# EAGLE design speech2 (EAGLE 7.6.0)
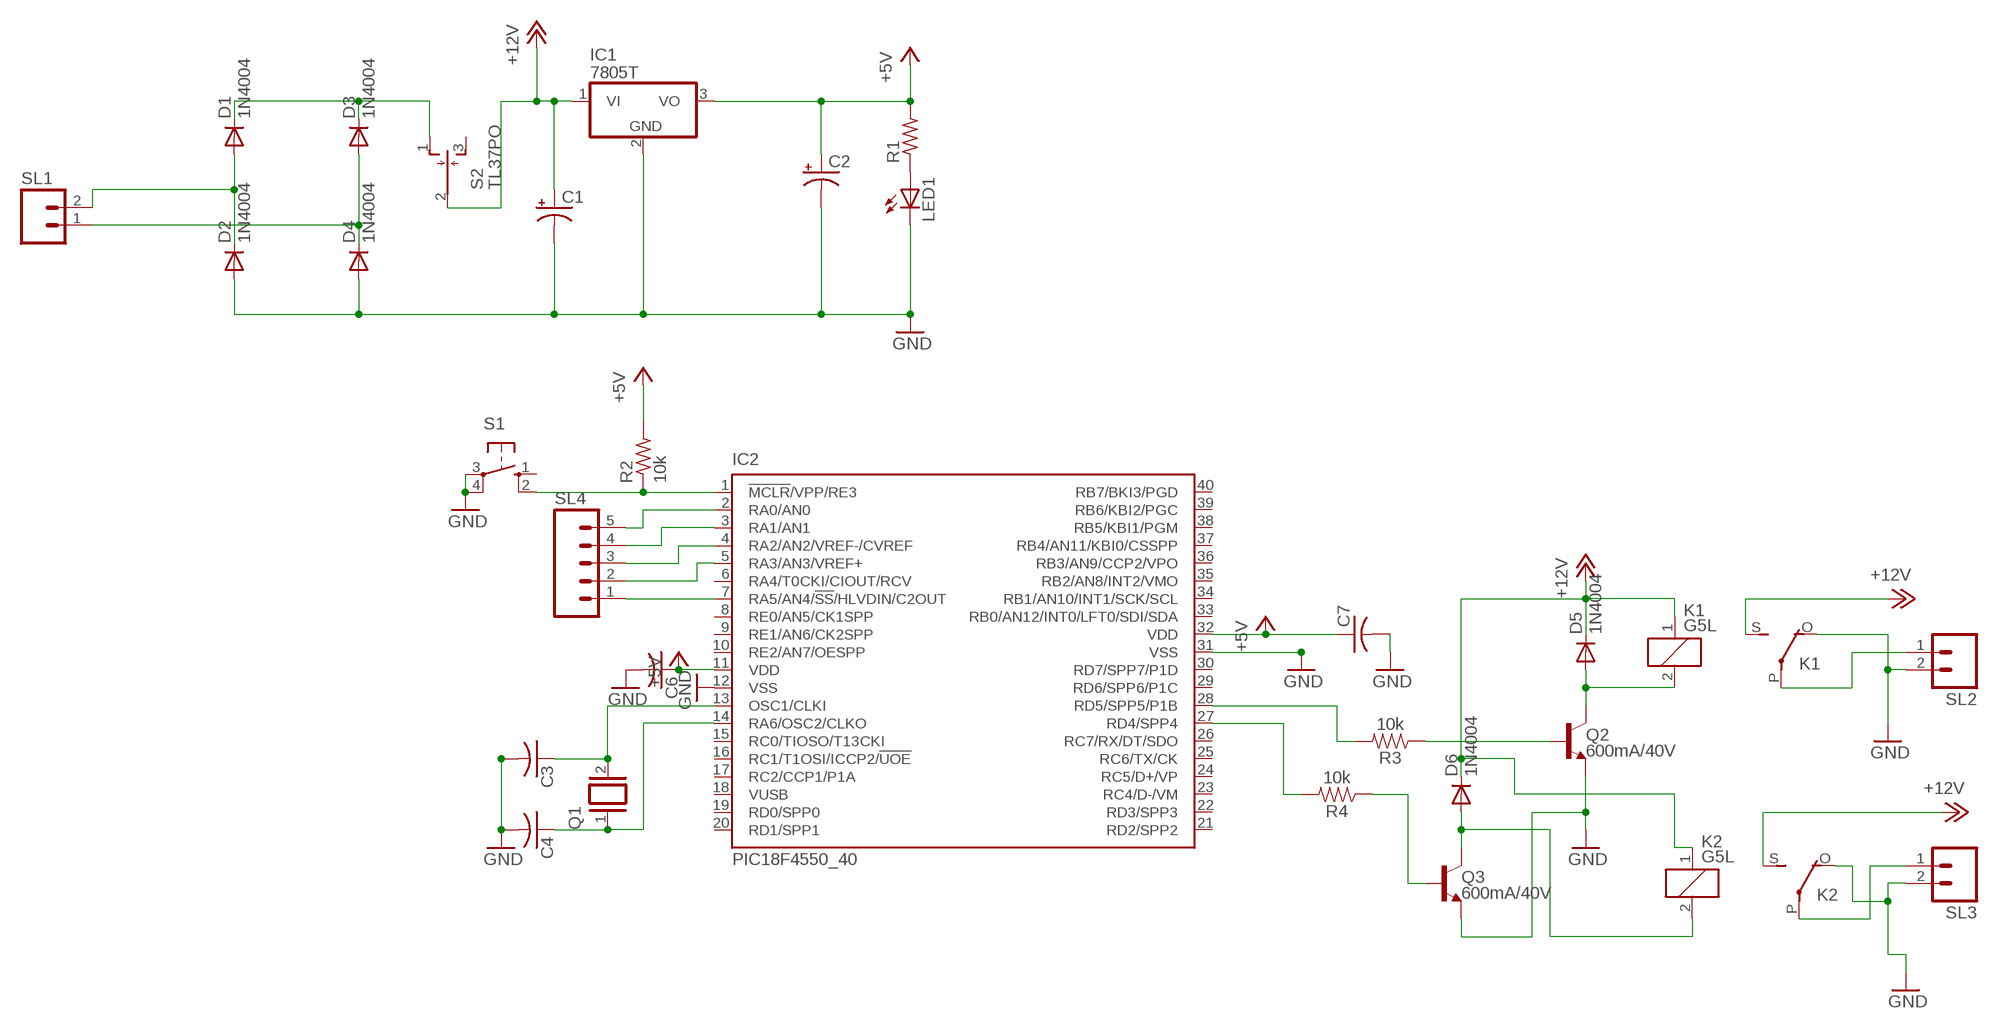
[diagram p0: schematic, sheet 1]

## Parts
C1  CPOL-USE3.5-8  [E3,5-8]
C2  CPOL-USE3.5-8  [E3,5-8]
C3  C-US025-024X044  [C025-024X044]
C4  C-US025-024X044  [C025-024X044]
C6  C-US025-024X044  [C025-024X044]
C7  C-US025-024X044  [C025-024X044]
D1  1N4004  [DO41-10]
D2  1N4004  [DO41-10]
D3  1N4004  [DO41-10]
D4  1N4004  [DO41-10]
D5  1N4004  [DO41-10]
D6  1N4004  [DO41-10]
IC1  7805T  [TO220H]
IC2  PIC18F4550_40  [DIL40]
K1  G5L  [G5LE]
K2  G5L  [G5LE]
LED1  LED5MM  [LED5MM]
Q1  XTAL/S  [QS]
Q2  600mA/40V  TRANS_NPN-P2N2222A  [TO-92]
Q3  600mA/40V  TRANS_NPN-P2N2222A  [TO-92]
R1  R-US_0207/10  [0207/10]
R2  10k  R-US_0207/10  [0207/10]
R3  10k  10KOHM-HORIZ-1/4W-1%  [AXIAL-0.3]
R4  10k  10KOHM-HORIZ-1/4W-1%  [AXIAL-0.3]
S1  10-XX  [B3F-10XX]
S2  TL37PO  [TL3XPO]
SL1  MA02  [02PA]
SL2  MA02  [02PA]
SL3  MA02  [02PA]
SL4  MA05  [05PA]

## Nets
+5V: C2.+ C6.1 C7.1 IC1.3(VO) IC2.11(VDD) IC2.32(VDD) R1.2 R2.2
+12V: C1.+ D5.C D6.C IC1.1(VI) K1.1 K1.S(2:S) K2.1 K2.S(2:S) S2.2(P)
GND: C1.- C2.- C3.2 C4.2 C6.2 C7.2 D2.A D4.A IC1.2(GND) IC2.12(VSS) IC2.31(VSS) K1.O(2:O) K2.O(2:O) LED1.K(C) Q2.3(E) Q3.3(E) S1.3(P) S1.4(P1) SL2.2 SL3.2
N$2: D1.A D2.C SL1.2
N$3: D3.A D4.C SL1.1
N$4: IC2.27(RD4/SPP4) R4.P$2
N$5: Q3.2(B) R4.P$1
N$6: LED1.A R1.1
N$8: D5.A K1.2 Q2.1(C)
N$9: IC2.2(RA0/AN0) SL4.5
N$10: IC2.28(RD5/SPP5/P1B) R3.P$2
N$11: IC2.1(!MCLR!/VPP/RE3) R2.1 S1.2(S1)
N$12: Q2.2(B) R3.P$1
N$13: IC2.3(RA1/AN1) SL4.4
N$14: IC2.4(RA2/AN2/VREF-/CVREF) SL4.3
N$15: IC2.5(RA3/AN3/VREF+) SL4.2
N$16: D6.A K2.2 Q3.1(C)
N$17: K2.P(2:P) SL3.1
N$18: IC2.7(RA5/AN4/!SS!/HLVDIN/C2OUT) SL4.1
N$22: K1.P(2:P) SL2.1
N$24: C4.1 IC2.14(RA6/OSC2/CLKO) Q1.1
N$25: C3.1 IC2.13(OSC1/CLKI) Q1.2
N$114: D1.C D3.C S2.1(O)
Unconnected: IC2.6(RA4/T0CKI/CIOUT/RCV) IC2.8(RE0/AN5/CK1SPP) IC2.9(RE1/AN6/CK2SPP) IC2.10(RE2/AN7/OESPP) IC2.15(RC0/TIOSO/T13CKI) IC2.16(RC1/T1OSI/ICCP2/!UOE) IC2.17(RC2/CCP1/P1A) IC2.18(VUSB) IC2.19(RD0/SPP0) IC2.20(RD1/SPP1) IC2.21(RD2/SPP2) IC2.22(RD3/SPP3) IC2.23(RC4/D-/VM) IC2.24(RC5/D+/VP) IC2.25(RC6/TX/CK) IC2.26(RC7/RX/DT/SDO) IC2.29(RD6/SPP6/P1C) IC2.30(RD7/SPP7/P1D) IC2.33(RB0/AN12/INT0/LFT0/SDI/SDA) IC2.34(RB1/AN10/INT1/SCK/SCL) IC2.35(RB2/AN8/INT2/VMO) IC2.36(RB3/AN9/CCP2/VPO) IC2.37(RB4/AN11/KBI0/CSSPP) IC2.38(RB5/KBI1/PGM) IC2.39(RB6/KBI2/PGC) IC2.40(RB7/BKI3/PGD) S1.1(S) S2.3(S)

## Library data of the parts
C1 C2 = adafruit:CPOL-US: POLARIZED CAPACITOR, American symbol
C3 C4 C6 C7 = adafruit:C-US: CAPACITOR, American symbol
D1-D6 = diode:1N4004: DIODE general purpose rectifier, 1 A
IC1 = adafruit:78*: Positive VOLTAGE REGULATOR Added bigger pads to the TO-92 package
IC2 = microchip:PIC18F4*_40: USB Microcontrollers with nanoWatt Technology High-Performance, Enhanced Flash, 28/40/44-Pin, Source: http://ww1.microchip.com/downloads/en/devicedoc/39632c.pdf; MF: MICROCHIP; MPN: PIC18F4550-I/P; OC_FARNELL: 9321357; OC_NEWARK: 74K8623
K1 K2 = relay:G5L: RELAY 1 x switch, 10 A/120 V AC, 8 A/30 V ADC, Omron; OC_FARNELL: unknown; OC_NEWARK: unknown
LED1 = adafruit:LED: LED OSRAM: - CHIPLED LG R971, LG N971, LY N971, LG Q971, LY Q971, LO R971, LY R971 LH N974, LH R974 LS Q976, LO Q976, LY Q976 LO Q996 - Hyper CHIPLED LW Q18S LB Q993, LB Q99A, LB R99A - SideLED LS A670, LO A670, LY A670, LG A670, LP A670 LB A673, LV A673, LT A673, LW A673 LH A674 LY A675 LS A676, LA A676, LO A676, LY A676, LW A676 LS A679, LY A679, LG A679 - Hyper Micro SIDELED® LS Y876, LA Y876, LO Y876, LY Y876 LT Y87S - SmartLED LW L88C, LW L88S LB L89C, LB L89S, LG L890 LS L89K, LO L89K, LY L89K LS L896, LA L896, LO L896, LY L896 - TOPLED LS T670, LO T670, LY T670, LG T670, LP T670 LSG T670, LSP T670, LSY T670, LOP T670, LYG T670 LG T671, LOG T671, LSG T671 LB T673, LV T673, LT T673, LW T673 LH T674 LS T676, LA T676, LO T676, LY T676, LB T676, LH T676, LSB T676, LW T676 LB T67C, LV T67C, LT T67C, LS T67K, LO T67K, LY T67K, LW E67C LS E67B, LA E67B, LO E67B, LY E67B, LB E67C, LV E67C, LT E67C LW T67C LS T679, LY T679, LG T679 LS T770, LO T770, LY T770, LG T770, LP T770 LB T773, LV T773, LT T773, LW T773 LH T774 LS E675, LA E675, LY E675, LS T675 LS T776, LA T776, LO T776, LY T776, LB T776 LHGB T686 LT T68C, LB T68C - Hyper Mini TOPLED® LB M676 - Mini TOPLED Santana® LG M470 LS M47K, LO M47K, LY M47K Source: http://www.osram.convergy.de/
Q1 = special:XTAL/S: CRYSTAL
Q2 Q3 = SparkFun-DiscreteSemi:TRANS_NPN: NPN transistor Current controlled devices typically used to amplify current or used as a switch. BC547 - COM-08928 <http://www.sparkfun.com/products/8928> (TO-92 45V 100mA) (1.Collector 2.Base 3.Emitter) 2N3904 - COM-00521 <http://www.sparkfun.com/products/521> (TO-92 40V 200mA) (1.Emitter 2.Base 3.Collector) P2N2222A - COM-12852 <http://www.sparkfun.com/products/12852> (TO-92 40V 600mA) (1.Collector 2.Base 3.Emitter); PROD_ID: TRANS-09536
R1 R2 = adafruit:R-US_: RESISTOR, American symbol
R3 R4 = SparkFun-Resistors:10KOHM: 10kΩ resistor A resistor is a passive two-terminal electrical component that implements electrical resistance as a circuit element. Resistors act to reduce current flow, and, at the same time, act to lower voltage levels within circuits. - Wikipedia; PROD_ID: RES-12183
S1 = switch-omron:10-XX: OMRON SWITCH; MPN: B3F-1000; OC_FARNELL: 176432; OC_NEWARK: 36M3542
S2 = switch:TL37PO: TINY SWITCH MOM OFF MOM Source: http://www2.produktinfo.conrad.com/datenblaetter/700000-724999/705152-da-01-de-Subminiaturschalter_TL_36YO.pdf
SL1-SL3 = con-amp-quick:MA02: AMP QUICK CONNECTOR; OC_FARNELL: unknown; OC_NEWARK: unknown
SL4 = con-amp-quick:MA05: AMP QUICK CONNECTOR; OC_FARNELL: unknown; OC_NEWARK: unknown

## Board
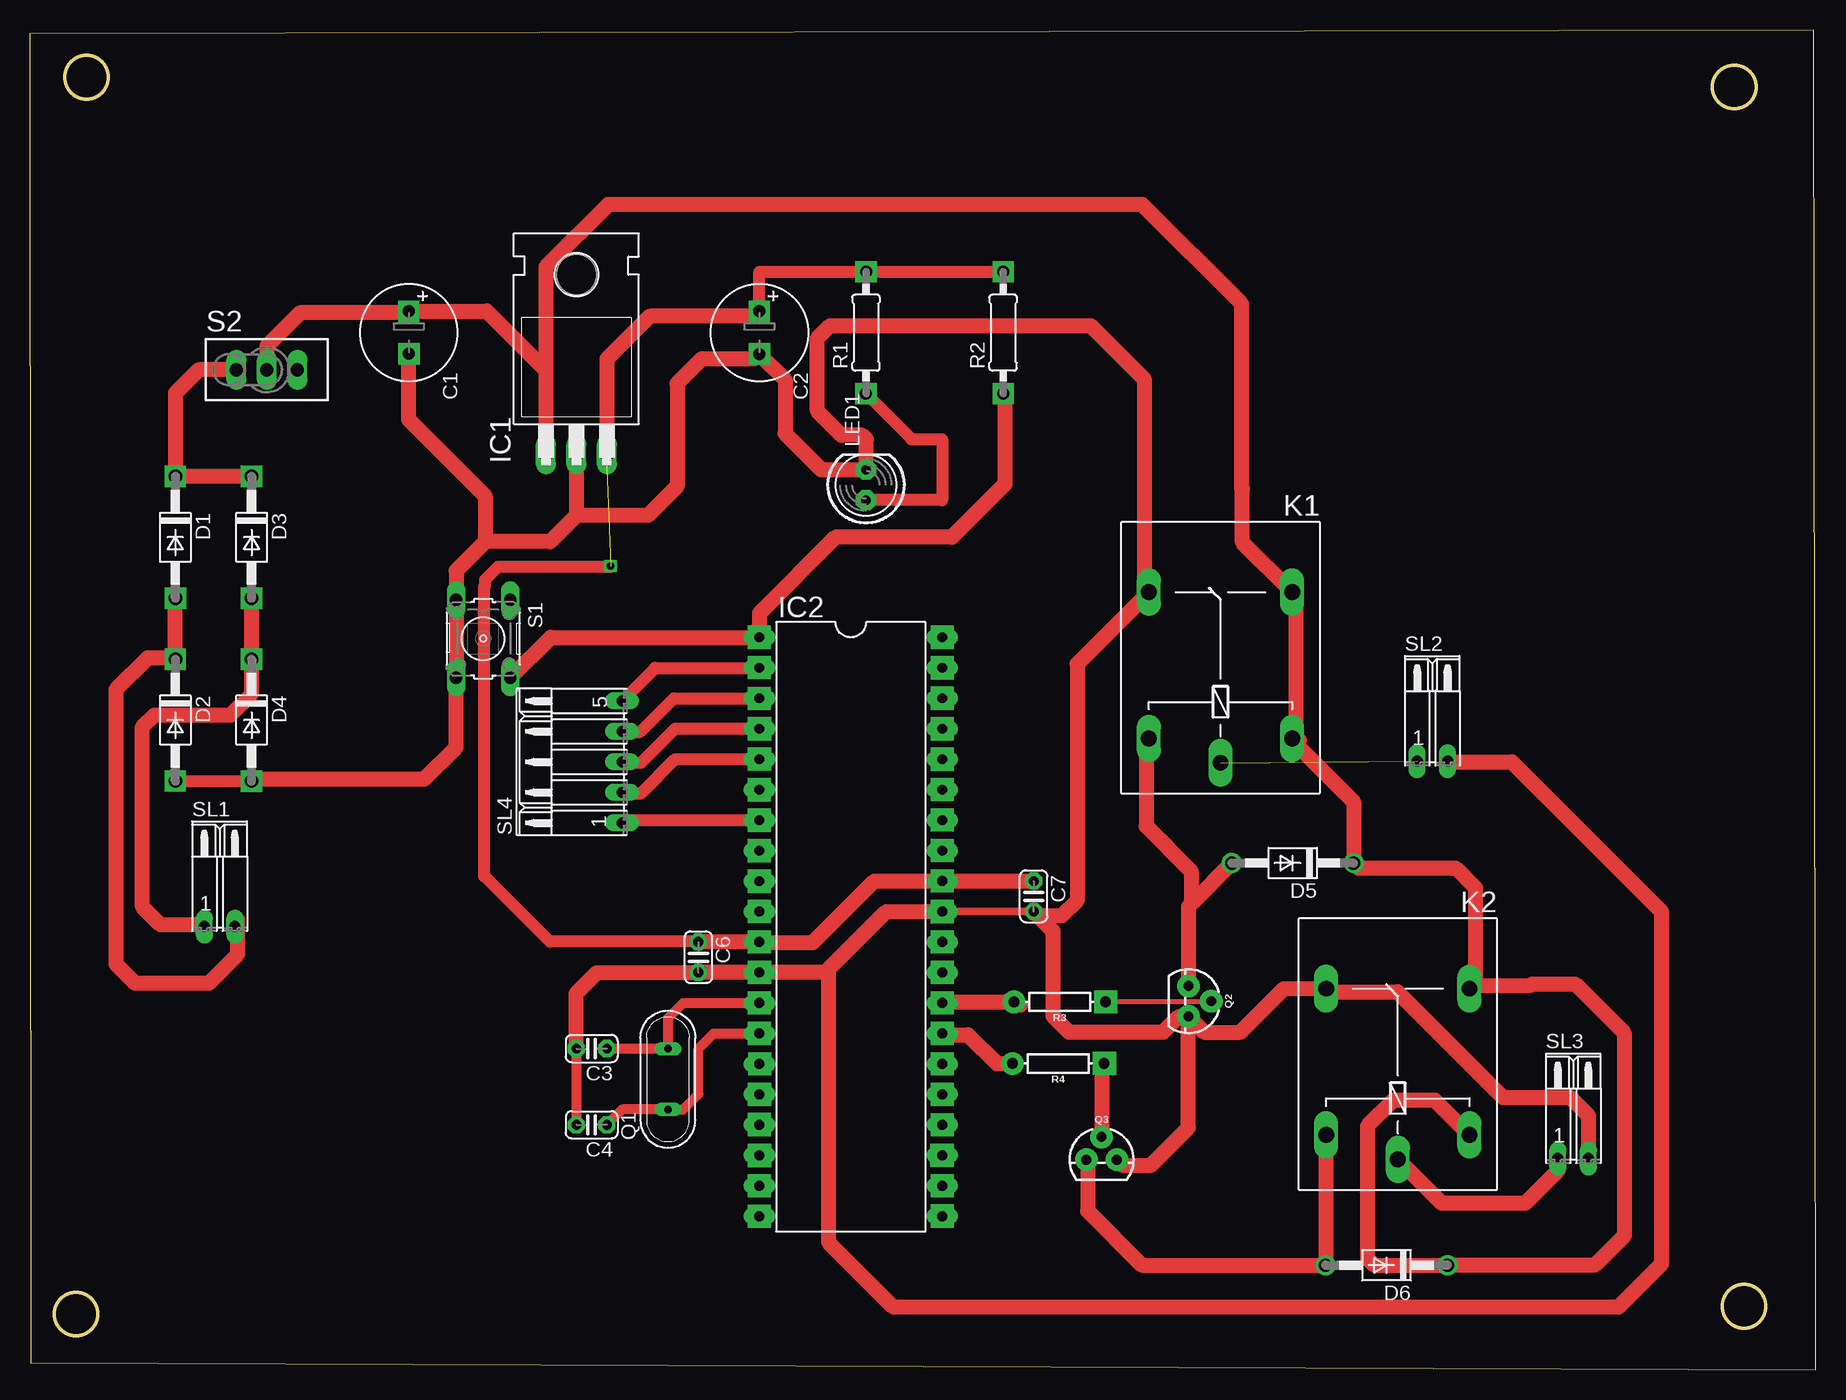
[diagram p1: board, top side]

Size 148.82 x 111.67 mm. Coordinates in mm from the lower left corner, seen from the top.
Outline: 0.08,0.55 148.82,0 148.63,111.67 0,111.36 0.08,0.55
Outline: circle at 4.71,107.74 radius 1.8
Outline: circle at 3.84,4.63 radius 1.8
Outline: circle at 142.84,5.27 radius 1.8
Outline: circle at 142.01,106.91 radius 1.8
Copper layers (1*16): Top 0.035mm / dielectric 1.5mm / Bottom 0.035mm
Design rules "default": minimum track width 10mil, minimum drill 24mil, track to track 8mil, track to pad 8mil, pad to pad 8mil, via to via 8mil, smd to smd 8mil, copper to edge 40mil, drill to drill 8mil, minimum pad ring 10mil, minimum via ring 8mil, stop-mask expansion 4mil, vias tented up to drill 0mil, thermal gap 10mil

### Footprints (pad centres in the part's own frame; a part is rotated, then mirrored left to right if it is on the bottom)
E3,5-8 = drill 0.813 pad 1.6: + -1.778,0 | drill 0.813 pad 1.6 octagon: - 1.778,0
C025-024X044 = drill 0.813 pad 1.422 octagon: 1 -1.27,0; 2 1.27,0
DO41-10 = drill 1.118: A 5.08,0; C -5.08,0
TO220H = drill 1.118 long: 1 -2.54,-10.16; 2 0,-10.16; 3 2.54,-10.16 | hole 3.302: 0,4.826
DIL40 = drill 0.813 long: 1 -24.13,-7.62; 2 -21.59,-7.62; 3 -19.05,-7.62; 4 -16.51,-7.62; 5 -13.97,-7.62; 6 -11.43,-7.62; 7 -8.89,-7.62; 8 -6.35,-7.62; 9 -3.81,-7.62; 10 -1.27,-7.62; 11 1.27,-7.62; 12 3.81,-7.62; 13 6.35,-7.62; 14 8.89,-7.62; 15 11.43,-7.62; 16 13.97,-7.62; 17 16.51,-7.62; 18 19.05,-7.62; 19 21.59,-7.62; 20 24.13,-7.62; 21 24.13,7.62; 22 21.59,7.62; 23 19.05,7.62; 24 16.51,7.62; 25 13.97,7.62; 26 11.43,7.62; 27 8.89,7.62; 28 6.35,7.62; 29 3.81,7.62; 30 1.27,7.62; 31 -1.27,7.62; 32 -3.81,7.62; 33 -6.35,7.62; 34 -8.89,7.62; 35 -11.43,7.62; 36 -13.97,7.62; 37 -16.51,7.62; 38 -19.05,7.62; 39 -21.59,7.62; 40 -24.13,7.62
G5LE = drill 1.321 long: 1 -7.493,-5.969; 2 -7.493,5.969; O 4.699,5.969; P -9.525,0; S 4.699,-5.969
LED5MM = drill 0.813 pad 1.676 octagon: A -1.27,0; K 1.27,0
QS = drill 0.61 long: 1 -2.54,0; 2 2.54,0
TO-92 = drill 0.813 pad 1.88: 1 -1.27,0; 2 0,1.905; 3 1.27,0
0207/10 = drill 0.813 pad 1.676 octagon: 1 -5.08,0; 2 5.08,0
AXIAL-0.3 = drill 0.9 pad 1.88: P$1 -3.81,0; P$2 3.81,0
B3F-10XX = drill 1.016 long: 1 -3.251,2.261; 2 3.251,2.261; 3 -3.251,-2.261; 4 3.251,-2.261
TL3XPO = drill 1.1 pad 1.422 long: 1 -2.54,0; 2 0,0; 3 2.54,0
02PA = drill 0.914 long: 1 -1.27,0; 2 1.27,0
05PA = drill 0.914 long: 1 -5.08,0; 2 -2.54,0; 3 0,0; 4 2.54,0; 5 5.08,0

### Placement (x,y rotation side)
C1  31.57,86.44 270 top
C2  60.78,86.44 270 top
C3  46.81,26.75 180 top
C4  46.81,20.4 180 top
C6  55.7,34.37 270 top
C7  83.64,39.45 270 top
D1  12.11,69.38 270 top
D2  12.11,54.14 270 top
D3  18.46,69.38 270 top
D4  18.46,54.14 270 top
D5  105.23,42.22 180 top
D6  113.05,8.69 180 top
IC1  45.54,86.44 0 top
IC2  68.4,36.91 270 top
K1  99.21,60.11 90 top
K2  113.98,27.05 90 top
LED1  69.67,73.74 90 top
Q1  53.16,24.21 90 top
Q2  96.53,30.71 270 top
Q3  89.3,17.48 0 top
R1  69.67,86.44 90 top
R2  81.1,86.44 90 top
R3  85.81,30.65 180 top
R4  85.68,25.51 180 top
S1  37.77,60.92 270 top
S2  19.73,83.34 0 top
SL1  15.8,36.93 0 top
SL2  116.86,50.73 0 top
SL3  128.6,17.59 0 top
SL4  49.34,50.66 90 top

### Tracks (layer width: path | path; a pad name or v marks a point on that pad's centre or on a via)
+5V  (1 unrouted)
  Top 1.016: C2.+ 60.78,91.52 R1.2 R2.2 | C6.1 55.66,35.67 43.31,35.67 37.85,41.14 37.85,65.27 37.93,65.35 37.93,65.85 39.01,66.92 48.45,66.92
  Top 1.27: C6.1 IC2.11 60.83,35.59 65.24,35.59 70.37,40.72 IC2.32 C7.1 | C2.+ 60.36,87.79 51.63,87.79 48.08,84.25 IC1.3
+12V
  Top 1.27: S2.2 19.73,85.32 22.51,88.1 31.45,88.1 C1.+ 31.6,88.25 38.07,88.25 43,83.32 | 43,83.32 43,81.4 IC1.1 | 105.48,52.14 105.48,64.5 K1.S 101.02,68.96 101.02,73.42 100.97,73.48 100.97,88.84 92.7,97.11 48.17,97.11 43,91.94 43,83.32 | 105.48,52.14 105.78,52.44 | 105.78,52.44 | 105.78,52.44 105.61,52.61 K1.1 | K2.1 117.06,22.45 113.6,22.45 111.46,20.31 111.46,9.26 112.03,8.69 D6.C 130.38,8.69 132.83,11.14 132.83,28.06 128.76,32.14 125.18,32.14 125.08,32.04 120.45,32.04 | K2.S 120.24,32.04 120.45,32.04 | 105.48,52.14 110.31,47.32 D5.C 110.72,41.81 118.79,41.81 120.45,40.15 120.45,32.04
GND
  Top 0.61: IC2.31 C7.2
  Top 0.813: C3.2 C4.2
  Top 1.016: D2.A D4.A
  Top 1.27: 66.56,33.38 66.35,33.16 60.84,33.16 IC2.12 C6.2 47.26,33.1 45.5,31.35 45.5,26.78 C3.2 | 66.56,33.38 71.37,38.18 IC2.31 | IC1.2 45.53,76.27 45.53,71.2 | 45.53,71.2 43.35,69.02 37.92,69.02 | 37.92,69.02 35.51,66.6 S1.3 S1.4 35.51,51.87 32.84,49.21 18.61,49.21 D4.A | C1.- 31.54,84.63 31.54,79.21 37.92,72.83 37.92,69.02 | 45.53,71.2 51.5,71.2 53.93,73.63 53.93,82.21 55.95,84.24 60.35,84.24 C2.- 62.93,82.51 62.93,78.02 65.94,75.01 LED1.K 69.69,75.03 69.69,77.55 69.35,77.89 67.62,77.89 65.62,79.9 65.62,85.97 66.65,87.01 88.4,87.01 92.84,82.57 92.84,64.41 | C7.2 84,37.82 | 84,37.82 85.24,36.58 85.24,29.47 86.56,28.14 94.44,28.14 95.74,29.44 Q2.3 | Q3.3 91.01,17.04 93.41,17.04 96.53,20.16 Q2.3 | Q2.3 97.86,28.11 100.86,28.11 104.5,31.75 K2.O 108.29,31.48 113.94,31.48 122.74,22.68 128.37,22.68 129.87,21.18 SL3.2 | K1.O 92.84,64.41 | 92.84,64.41 87.25,58.82 87.25,39.08 85.99,37.82 84,37.82 | SL2.2 118.21,50.65 123.5,50.65 135.96,38.19 135.96,8.78 132.37,5.2 71.94,5.2 66.56,10.57 66.56,33.38
N$2
  Top 1.27: D1.A D2.C 12,59.33 9.81,59.33 7.16,56.68 7.16,33.81 8.75,32.22 14.93,32.22 17.31,34.61 17.31,37.52 17.07,37.28 SL1.2
N$3
  Top 1.27: D3.A D4.C 18.46,56.33 16.69,54.56 10.34,54.56 9.36,53.59 9.36,38.58 10.87,37.08 14.38,37.08 SL1.1
N$4
  Top 1.27: IC2.27 76.13,27.9 78.16,27.9 80.55,25.51 R4.P$2
N$5
  Top 1.27: R4.P$1 89.3,25.31 Q3.2
N$6
  Top 1.016: R1.1 73.48,77.55 76.02,77.55 76.02,72.47 LED1.A
N$8
  Top 1.27: D5.A 96.76,38.83 | 96.76,38.83 96.53,38.6 Q2.1 | K1.2 93,52.38 93,45.29 96.76,41.54 96.76,38.83
N$9
  Top 1.016: SL4.5 52.1,58.5 IC2.2
N$10
  Top 1.27: IC2.28 76.18,30.4 76.43,30.65 R3.P$2 82.27,30.65 82.52,30.4
N$11
  Top 1.27: S1.2 43.4,61.04 IC2.1 60.78,63.04 67.12,69.38 76.83,69.38 81.25,73.8 81.25,81.21 R2.1
N$12
  Top 0.406: R3.P$1 89.68,30.71 Q2.2
N$13
  Top 1.016: SL4.4 49.37,53.16 50.85,53.16 53.65,55.96 IC2.3
N$14
  Top 1.016: SL4.3 49.4,50.59 50.94,50.59 53.76,53.42 IC2.4
N$15
  Top 1.016: SL4.2 49.43,48.02 50.94,48.02 53.79,50.88 IC2.5
N$16
  Top 1.27: Q3.1 88.14,17.37 88.14,13.21 92.66,8.69 D6.A 107.97,19.51 K2.2
N$17
  Top 1.27: K2.P 117.62,13.89 124.64,13.89 127.33,16.58 SL3.1
N$18
  Top 1.016: SL4.1 49.56,45.8 IC2.7
N$19  (via drill 0.6)
  other vias: 48.37,66.99
N$22  (1 unrouted)
N$24
  Top 0.813: C4.1 49.35,21.67 Q1.1 54.43,21.67 55.7,22.94 55.7,26.75 56.97,28.02 IC2.14
N$25
  Top 0.813: C3.1 Q1.2 53.16,29.29 54.43,30.56 IC2.13
N$52  (via drill 1 pad 1.78)
  other vias: 81.1,81.35
N$53  (via drill 1 pad 1.78)
  other vias: 81.1,91.52
N$54  (via drill 1 pad 1.78)
  other vias: 69.67,91.52
N$55  (via drill 1 pad 1.78)
  other vias: 69.66,81.36
N$56  (via drill 1 pad 1.78)
  other vias: 60.78,88.22
N$57  (via drill 1 pad 1.78)
  other vias: 60.79,84.66
N$58  (via drill 1 pad 1.78)
  other vias: 31.56,88.22
N$59  (via drill 1 pad 1.78)
  other vias: 31.57,84.67
N$60  (via drill 1 pad 1.78)
  other vias: 18.46,74.46
N$61  (via drill 1 pad 1.78)
  other vias: 18.47,64.3
N$62  (via drill 1 pad 1.78)
  other vias: 18.47,59.21
N$63  (via drill 1 pad 1.78)
  other vias: 18.47,49.05
N$64  (via drill 1 pad 1.78)
  other vias: 12.11,49.06
N$65  (via drill 1 pad 1.78)
  other vias: 12.12,64.3
N$66  (via drill 1 pad 1.78)
  other vias: 12.1,74.45
N$67  (via drill 1 pad 1.78)
  other vias: 12.11,59.21
N$68  (via drill 0.8 pad 1.93)
  other vias: 60.77,61.04
N$69  (via drill 0.8 pad 1.93)
  other vias: 60.78,58.51
N$70  (via drill 0.8 pad 1.93)
  other vias: 60.78,55.95
N$71  (via drill 0.8 pad 1.93)
  other vias: 60.79,53.41
N$72  (via drill 0.8 pad 1.93)
  other vias: 60.79,50.89
N$73  (via drill 0.8 pad 1.93)
  other vias: 60.77,48.34
N$74  (via drill 0.8 pad 1.93)
  other vias: 60.78,45.79
N$75  (via drill 0.8 pad 1.93)
  other vias: 60.77,43.25
N$76  (via drill 0.8 pad 1.93)
  other vias: 60.78,40.72
N$77  (via drill 0.8 pad 1.93)
  other vias: 60.78,38.18
N$78  (via drill 0.8 pad 1.93)
  other vias: 60.78,35.64
N$79  (via drill 0.8 pad 1.93)
  other vias: 60.79,33.11
N$80  (via drill 0.8 pad 1.93)
  other vias: 60.78,30.57
N$81  (via drill 0.8 pad 1.93)
  other vias: 60.78,28.01
N$82  (via drill 0.8 pad 1.93)
  other vias: 60.8,25.48
N$83  (via drill 0.8 pad 1.93)
  other vias: 60.79,22.95
N$84  (via drill 0.8 pad 1.93)
  other vias: 60.77,20.41
N$85  (via drill 0.8 pad 1.93)
  other vias: 60.79,17.84
N$86  (via drill 0.8 pad 1.93)
  other vias: 60.78,15.32
N$87  (via drill 0.8 pad 1.93)
  other vias: 60.78,12.78
N$90  (via drill 0.8 pad 1.93)
  other vias: 76.02,12.79
N$91  (via drill 0.8 pad 1.93)
  other vias: 76.02,15.31
N$92  (via drill 0.8 pad 1.93)
  other vias: 76.01,17.86
N$93  (via drill 0.8 pad 1.93)
  other vias: 76.02,20.4
N$94  (via drill 0.8 pad 1.93)
  other vias: 76.02,22.94
N$95  (via drill 0.8 pad 1.93)
  other vias: 76.01,25.48
N$96  (via drill 0.8 pad 1.93)
  other vias: 76.01,28.02
N$97  (via drill 0.8 pad 1.93)
  other vias: 76.01,30.56
N$98  (via drill 0.8 pad 1.93)
  other vias: 76.01,33.11
N$99  (via drill 0.8 pad 1.93)
  other vias: 76.01,35.65
N$100  (via drill 0.8 pad 1.93)
  other vias: 76.02,38.17
N$101  (via drill 0.8 pad 1.93)
  other vias: 76.02,40.73
N$102  (via drill 0.8 pad 1.93)
  other vias: 76.01,43.26
N$103  (via drill 0.8 pad 1.93)
  other vias: 76.01,45.81
N$104  (via drill 0.8 pad 1.93)
  other vias: 76.02,48.35
N$105  (via drill 0.8 pad 1.93)
  other vias: 76.02,50.88
N$106  (via drill 0.8 pad 1.93)
  other vias: 76.01,53.42
N$107  (via drill 0.8 pad 1.93)
  other vias: 76.02,55.96
N$108  (via drill 0.8 pad 1.93)
  other vias: 76.02,58.5
N$109  (via drill 0.8 pad 1.93)
  other vias: 76.01,61.04
N$112  (via drill 0.8 pad 1.93)
  other vias: 89.55,25.53
N$113  (via drill 0.8 pad 1.93)
  other vias: 89.63,30.65
N$114
  Top 1.27: D3.C D1.C 12.11,81.41 14.05,83.35 S2.1